# EAGLE design BBB_TFT (EAGLE 6.4)
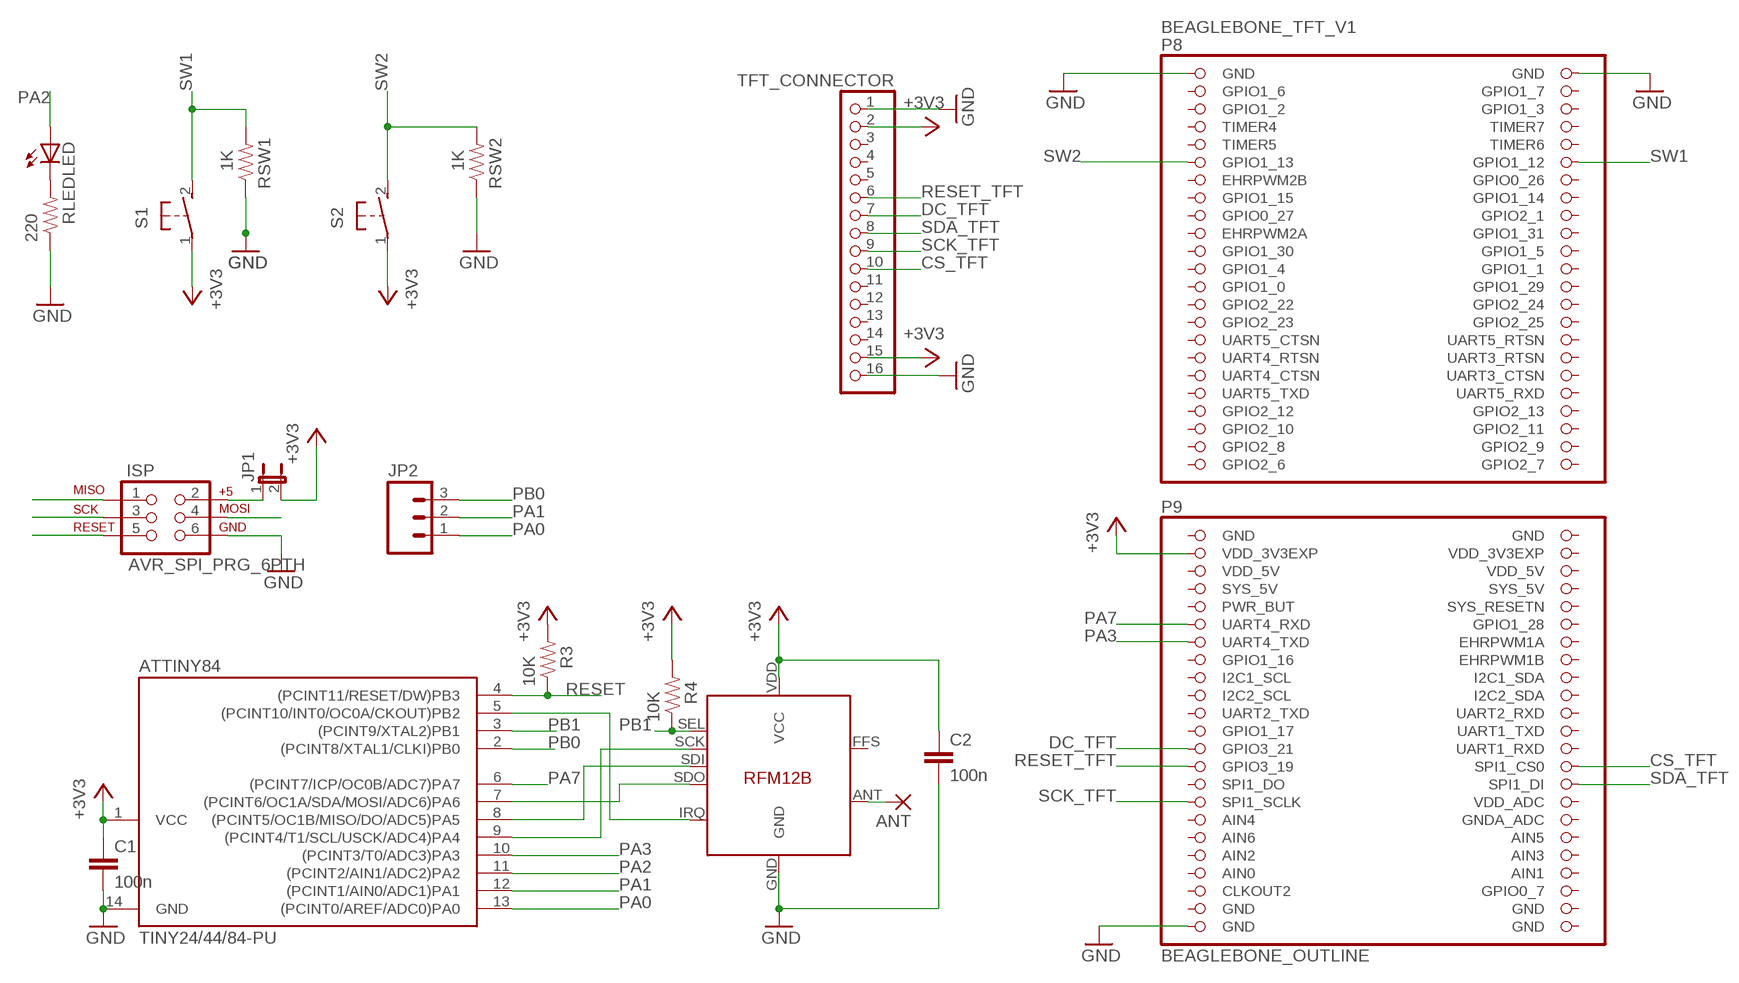
[diagram p0: schematic, sheet 1]

## Parts
ANT  1,6/0,8  [1,6/0,8]
ATTINY84  TINY24/44/84-PU  [DIL14]
BEAGLEBONE_TFT_V1  BEAGLEBONE_OUTLINE  [BEAGLEBONE_SHIELD]
C1  100n  C-EU025-024X044  [C025-024X044]
C2  100n  C-EU025-024X044  [C025-024X044]
ISP  AVR_SPI_PRG_6PTH  [2X3]
JP1  JUMPER-2PTH  [1X02]
JP2  M03LOCK  [1X03_LOCK]
LED  LED5MM  [LED5MM]
R3  10K  RESISTORAXIAL-0.3  [AXIAL-0.3]
R4  10K  RESISTORAXIAL-0.3  [AXIAL-0.3]
RFM12B  RFM12B  [RFM12B]
RLED  220  RESISTORAXIAL-0.3  [AXIAL-0.3]
RSW1  1K  RESISTORAXIAL-0.3  [AXIAL-0.3]
RSW2  1K  RESISTORAXIAL-0.3  [AXIAL-0.3]
S1  31-XX  [B3F-31XX]
S2  31-XX  [B3F-31XX]
TFT_CONNECTOR  PINHD-1X16  [1X16]

## Nets
+3V3 [power]: ATTINY84.1(VCC) BEAGLEBONE_TFT_V1.49(VDD_3V3EXP) C1.1 C2.1 JP1.2 R3.P$2 R4.P$2 RFM12B.VDD(VCC) S1.1(P) S2.1(P) TFT_CONNECTOR.2 TFT_CONNECTOR.15
CS_TFT: BEAGLEBONE_TFT_V1.74(SPI1_CS0) TFT_CONNECTOR.10
DC_TFT: BEAGLEBONE_TFT_V1.71(GPIO3_21) TFT_CONNECTOR.7
GND [power]: ATTINY84.14(GND) BEAGLEBONE_TFT_V1.1(GND) BEAGLEBONE_TFT_V1.2(GND) BEAGLEBONE_TFT_V1.91(GND) C1.2 C2.2 ISP.6 RFM12B.GND RLED.P$1 RSW1.P$1 RSW2.P$1 TFT_CONNECTOR.1 TFT_CONNECTOR.16
MISO: ATTINY84.8((PCINT5/OC1B/MISO/DO/ADC5)PA5) ISP.1 RFM12B.SDI
MOSI: ATTINY84.7((PCINT6/OC1A/SDA/MOSI/ADC6)PA6) ISP.4 RFM12B.SDO
N$1: ISP.2 JP1.1
N$3: LED.K(C) RLED.P$2
N$6 [power]: ANT.1(P) RFM12B.ANT
PA0: ATTINY84.13((PCINT0/AREF/ADC0)PA0) JP2.1
PA1 [power]: ATTINY84.12((PCINT1/AIN0/ADC1)PA1) JP2.2
PA2: ATTINY84.11((PCINT2/AIN1/ADC2)PA2) LED.A
PA3: ATTINY84.10((PCINT3/T0/ADC3)PA3) BEAGLEBONE_TFT_V1.59(UART4_TXD)
PA7: ATTINY84.6((PCINT7/ICP/OC0B/ADC7)PA7) BEAGLEBONE_TFT_V1.57(UART4_RXD)
PB0: ATTINY84.2((PCINT8/XTAL1/CLKI)PB0) JP2.3
PB1: ATTINY84.3((PCINT9/XTAL2)PB1) R4.P$1 RFM12B.SEL
PB2: ATTINY84.5((PCINT10/INT0/OC0A/CKOUT)PB2) RFM12B.IRQ
RESET: ATTINY84.4((PCINT11/RESET/DW)PB3) ISP.5 R3.P$1
RESET_TFT: BEAGLEBONE_TFT_V1.73(GPIO3_19) TFT_CONNECTOR.6
SCK: ATTINY84.9((PCINT4/T1/SCL/USCK/ADC4)PA4) ISP.3 RFM12B.SCK
SCK_TFT: BEAGLEBONE_TFT_V1.77(SPI1_SCLK) TFT_CONNECTOR.9
SDA_TFT: BEAGLEBONE_TFT_V1.76(SPI1_DI) TFT_CONNECTOR.8
SW1: BEAGLEBONE_TFT_V1.12(GPIO1_12) RSW1.P$2 S1.2(S)
SW2: BEAGLEBONE_TFT_V1.11(GPIO1_13) RSW2.P$2 S2.2(S)
Unconnected: BEAGLEBONE_TFT_V1.3(GPIO1_6) BEAGLEBONE_TFT_V1.4(GPIO1_7) BEAGLEBONE_TFT_V1.5(GPIO1_2) BEAGLEBONE_TFT_V1.6(GPIO1_3) BEAGLEBONE_TFT_V1.7(TIMER4) BEAGLEBONE_TFT_V1.8(TIMER7) BEAGLEBONE_TFT_V1.9(TIMER5) BEAGLEBONE_TFT_V1.10(TIMER6) BEAGLEBONE_TFT_V1.13(EHRPWM2B) BEAGLEBONE_TFT_V1.14(GPIO0_26) BEAGLEBONE_TFT_V1.15(GPIO1_15) BEAGLEBONE_TFT_V1.16(GPIO1_14) BEAGLEBONE_TFT_V1.17(GPIO0_27) BEAGLEBONE_TFT_V1.18(GPIO2_1) BEAGLEBONE_TFT_V1.19(EHRPWM2A) BEAGLEBONE_TFT_V1.20(GPIO1_31) BEAGLEBONE_TFT_V1.21(GPIO1_30) BEAGLEBONE_TFT_V1.22(GPIO1_5) BEAGLEBONE_TFT_V1.23(GPIO1_4) BEAGLEBONE_TFT_V1.24(GPIO1_1) BEAGLEBONE_TFT_V1.25(GPIO1_0) BEAGLEBONE_TFT_V1.26(GPIO1_29) BEAGLEBONE_TFT_V1.27(GPIO2_22) BEAGLEBONE_TFT_V1.28(GPIO2_24) BEAGLEBONE_TFT_V1.29(GPIO2_23) BEAGLEBONE_TFT_V1.30(GPIO2_25) BEAGLEBONE_TFT_V1.31(UART5_CTSN) BEAGLEBONE_TFT_V1.32(UART5_RTSN) BEAGLEBONE_TFT_V1.33(UART4_RTSN) BEAGLEBONE_TFT_V1.34(UART3_RTSN) BEAGLEBONE_TFT_V1.35(UART4_CTSN) BEAGLEBONE_TFT_V1.36(UART3_CTSN) BEAGLEBONE_TFT_V1.37(UART5_TXD) BEAGLEBONE_TFT_V1.38(UART5_RXD) BEAGLEBONE_TFT_V1.39(GPIO2_12) BEAGLEBONE_TFT_V1.40(GPIO2_13) BEAGLEBONE_TFT_V1.41(GPIO2_10) BEAGLEBONE_TFT_V1.42(GPIO2_11) BEAGLEBONE_TFT_V1.43(GPIO2_8) BEAGLEBONE_TFT_V1.44(GPIO2_9) BEAGLEBONE_TFT_V1.45(GPIO2_6) BEAGLEBONE_TFT_V1.46(GPIO2_7) BEAGLEBONE_TFT_V1.54(SYS_5V) BEAGLEBONE_TFT_V1.55(PWR_BUT) BEAGLEBONE_TFT_V1.56(SYS_RESETN) BEAGLEBONE_TFT_V1.58(GPIO1_28) BEAGLEBONE_TFT_V1.60(EHRPWM1A) BEAGLEBONE_TFT_V1.61(GPIO1_16) BEAGLEBONE_TFT_V1.62(EHRPWM1B) BEAGLEBONE_TFT_V1.63(I2C1_SCL) BEAGLEBONE_TFT_V1.64(I2C1_SDA) BEAGLEBONE_TFT_V1.65(I2C2_SCL) BEAGLEBONE_TFT_V1.66(I2C2_SDA) BEAGLEBONE_TFT_V1.67(UART2_TXD) BEAGLEBONE_TFT_V1.68(UART2_RXD) BEAGLEBONE_TFT_V1.69(GPIO1_17) BEAGLEBONE_TFT_V1.70(UART1_TXD) BEAGLEBONE_TFT_V1.72(UART1_RXD) BEAGLEBONE_TFT_V1.75(SPI1_DO) BEAGLEBONE_TFT_V1.78(VDD_ADC) BEAGLEBONE_TFT_V1.79(AIN4) BEAGLEBONE_TFT_V1.80(GNDA_ADC) BEAGLEBONE_TFT_V1.81(AIN6) BEAGLEBONE_TFT_V1.82(AIN5) BEAGLEBONE_TFT_V1.83(AIN2) BEAGLEBONE_TFT_V1.84(AIN3) BEAGLEBONE_TFT_V1.86(AIN1) BEAGLEBONE_TFT_V1.87(CLKOUT2) BEAGLEBONE_TFT_V1.88(GPIO0_7) RFM12B.FFS TFT_CONNECTOR.3 TFT_CONNECTOR.4 TFT_CONNECTOR.5 TFT_CONNECTOR.11 TFT_CONNECTOR.12 TFT_CONNECTOR.13 TFT_CONNECTOR.14

## Power pins joined to a net without a drawn wire
AIN0: BEAGLEBONE_TFT_V1.85(AIN0)
GND: BEAGLEBONE_TFT_V1.47(GND) BEAGLEBONE_TFT_V1.48(GND) BEAGLEBONE_TFT_V1.89(GND) BEAGLEBONE_TFT_V1.90(GND) BEAGLEBONE_TFT_V1.92(GND)
SYS_5V: BEAGLEBONE_TFT_V1.53(SYS_5V)
VDD_3V3EXP: BEAGLEBONE_TFT_V1.50(VDD_3V3EXP)
VDD_5V: BEAGLEBONE_TFT_V1.51(VDD_5V) BEAGLEBONE_TFT_V1.52(VDD_5V)

## Library data of the parts
ANT = JeeLabs:1,6/0,8: THROUGH-HOLE PAD
ATTINY84 = avr-7:TINY24/44/84
BEAGLEBONE_TFT_V1 = adafruit:BEAGLEBONE_OUTLINE: Should match A3 pinout - but not completely tested
C1 C2 = rcl:C-EU: CAPACITOR, European symbol
ISP = SparkFun:AVR_SPI_PRG_6: AVR ISP 6 Pin This is the reduced ISP connector for AVR programming. Common on Arduino. This footprint will take up less PCB space and can be used with a 10-pin to 6-pin adapter such as SKU: BOB-08508
JP1 = SparkFun:JUMPER-2: Jumper Basic 0.1" spaced jumper. Use with breakaway headers.
JP2 = SparkFun:M03: Header 3 Standard 3-pin 0.1" header. Use with straight break away headers (SKU : PRT-00116), right angle break away headers (PRT-00553), swiss pins (PRT-00743), machine pins (PRT-00117), and female headers (PRT-00115). Molex polarized connector foot print use with SKU : PRT-08232 with associated crimp pins and housings.
LED = led:LED: LED OSRAM: - CHIPLED LG R971, LG N971, LY N971, LG Q971, LY Q971, LO R971, LY R971 LH N974, LH R974 LS Q976, LO Q976, LY Q976 LO Q996 - Hyper CHIPLED LW Q18S LB Q993, LB Q99A, LB R99A - SideLED LS A670, LO A670, LY A670, LG A670, LP A670 LB A673, LV A673, LT A673, LW A673 LH A674 LY A675 LS A676, LA A676, LO A676, LY A676, LW A676 LS A679, LY A679, LG A679 - Hyper Micro SIDELED® LS Y876, LA Y876, LO Y876, LY Y876 LT Y87S - SmartLED LW L88C, LW L88S LB L89C, LB L89S, LG L890 LS L89K, LO L89K, LY L89K LS L896, LA L896, LO L896, LY L896 - TOPLED LS T670, LO T670, LY T670, LG T670, LP T670 LSG T670, LSP T670, LSY T670, LOP T670, LYG T670 LG T671, LOG T671, LSG T671 LB T673, LV T673, LT T673, LW T673 LH T674 LS T676, LA T676, LO T676, LY T676, LB T676, LH T676, LSB T676, LW T676 LB T67C, LV T67C, LT T67C, LS T67K, LO T67K, LY T67K, LW E67C LS E67B, LA E67B, LO E67B, LY E67B, LB E67C, LV E67C, LT E67C LW T67C LS T679, LY T679, LG T679 LS T770, LO T770, LY T770, LG T770, LP T770 LB T773, LV T773, LT T773, LW T773 LH T774 LS E675, LA E675, LY E675, LS T675 LS T776, LA T776, LO T776, LY T776, LB T776 LHGB T686 LT T68C, LB T68C - Hyper Mini TOPLED® LB M676 - Mini TOPLED Santana® LG M470 LS M47K, LO M47K, LY M47K Source: http://www.osram.convergy.de LUXEON: - LUMILED® LXK2-PW12-R00, LXK2-PW12-S00, LXK2-PW14-U00, LXK2-PW14-V00 LXK2-PM12-R00, LXK2-PM12-S00, LXK2-PM14-U00 LXK2-PE12-Q00, LXK2-PE12-R00, LXK2-PE12-S00, LXK2-PE14-T00, LXK2-PE14-U00 LXK2-PB12-K00, LXK2-PB12-L00, LXK2-PB12-M00, LXK2-PB14-N00, LXK2-PB14-P00, LXK2-PB14-Q00 LXK2-PR12-L00, LXK2-PR12-M00, LXK2-PR14-Q00, LXK2-PR14-R00 LXK2-PD12-Q00, LXK2-PD12-R00, LXK2-PD12-S00 LXK2-PH12-R00, LXK2-PH12-S00 LXK2-PL12-P00, LXK2-PL12-Q00, LXK2-PL12-R00 Source: www.luxeon.com KINGBRIGHT: KA-3528ASYC Source: www.kingbright.com
R3 R4 RLED RSW1 RSW2 = SparkFun:RESISTOR: Resistor Basic schematic elements and footprints for 0603, 1206, and PTH resistors.
RFM12B = JeeLabs:RFM12B
S1 S2 = switch-omron:31-XX: OMRON SWITCH; MPN: B3F-3100; OC_FARNELL: 959704; OC_NEWARK: 36M3582
TFT_CONNECTOR = pinhead:PINHD-1X16: PIN HEADER

## Net classes
0 default: width 0.254 mm, drill 0.254 mm, clearance 0.254 mm
1 power: width 0.305 mm, drill 0.305 mm, clearance 0.305 mm

## Board
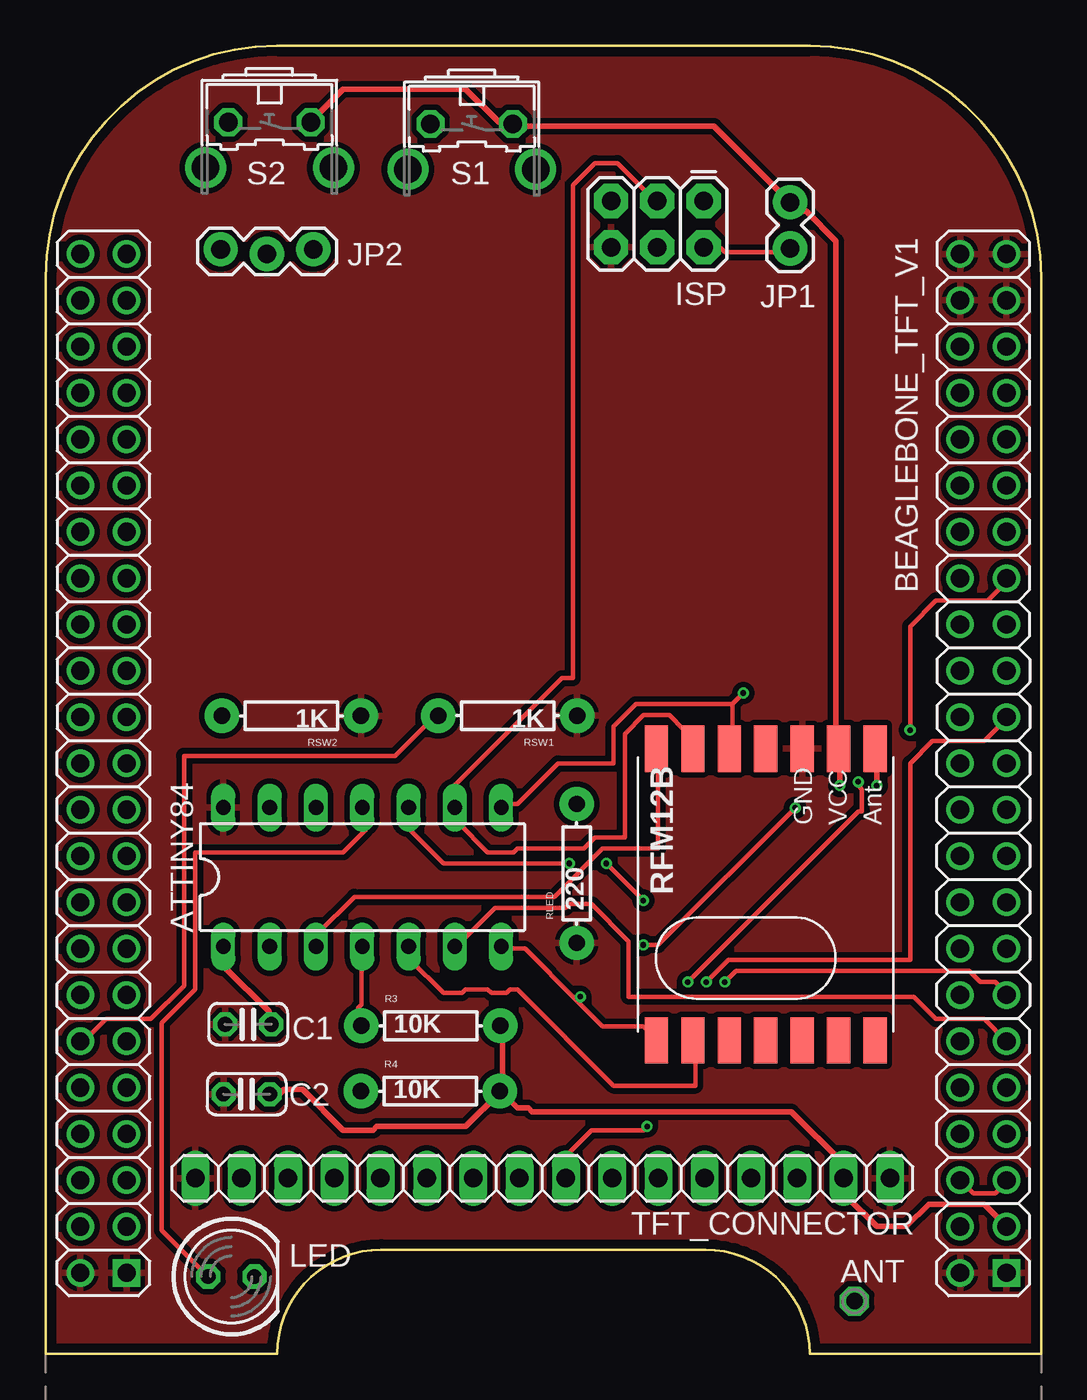
[diagram p1: board, top side]
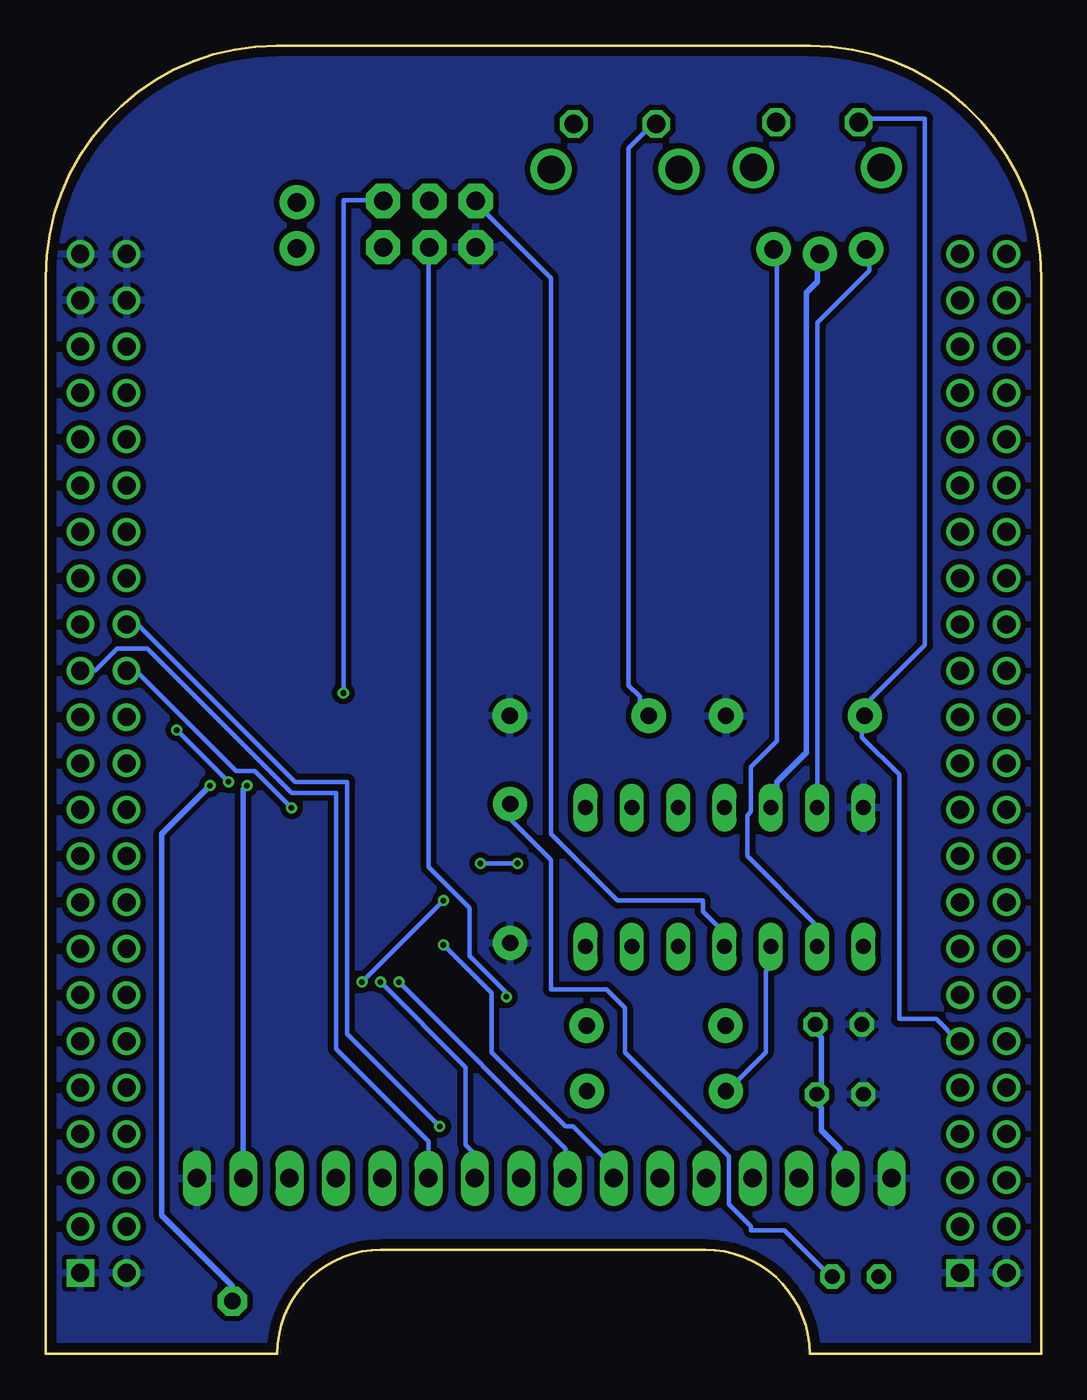
[diagram p2: board, bottom side, seen from below]

Size 54.61 x 71.75 mm. Coordinates in mm from the lower left corner, seen from the top.
Copper layers (1*16): Top 0.035mm / dielectric 1.5mm / Bottom 0.035mm
Design rules "EagleRules": minimum track width 7mil, minimum drill 12mil, track to track 7mil, track to pad 7mil, pad to pad 7mil, via to via 7mil, smd to smd 0mil, copper to edge 20mil, drill to drill 10mil, minimum pad ring 10mil, minimum via ring 6mil, stop-mask expansion 2mil, vias tented up to drill 25mil, thermal gap 10mil

### Footprints (pad centres in the part's own frame; a part is rotated, then mirrored left to right if it is on the bottom)
1,6/0,8 = drill 0.9 pad 1.6 octagon: 1 0,0
DIL14 = drill 0.813 long: 1 -7.62,-3.81; 2 -5.08,-3.81; 3 -2.54,-3.81; 4 0,-3.81; 5 2.54,-3.81; 6 5.08,-3.81; 7 7.62,-3.81; 8 7.62,3.81; 9 5.08,3.81; 10 2.54,3.81; 11 0,3.81; 12 -2.54,3.81; 13 -5.08,3.81; 14 -7.62,3.81
BEAGLEBONE_SHIELD = drill 1 square: 1 4.445,19.05; 47 52.705,19.05 | drill 1: 2 1.905,19.05; 3 4.445,21.59; 4 1.905,21.59; 5 4.445,24.13; 6 1.905,24.13; 7 4.445,26.67; 8 1.905,26.67; 9 4.445,29.21; 10 1.905,29.21; 11 4.445,31.75; 12 1.905,31.75; 13 4.445,34.29; 14 1.905,34.29; 15 4.445,36.83; 16 1.905,36.83; 17 4.445,39.37; 18 1.905,39.37; 19 4.445,41.91; 20 1.905,41.91; 21 4.445,44.45; 22 1.905,44.45; 23 4.445,46.99; 24 1.905,46.99; 25 4.445,49.53; 26 1.905,49.53; 27 4.445,52.07; 28 1.905,52.07; 29 4.445,54.61; 30 1.905,54.61; 31 4.445,57.15; 32 1.905,57.15; 33 4.445,59.69; 34 1.905,59.69; 35 4.445,62.23; 36 1.905,62.23; 37 4.445,64.77; 38 1.905,64.77; 39 4.445,67.31; 40 1.905,67.31; 41 4.445,69.85; 42 1.905,69.85; 43 4.445,72.39; 44 1.905,72.39; 45 4.445,74.93; 46 1.905,74.93; 48 50.165,19.05; 49 52.705,21.59; 50 50.165,21.59; 51 52.705,24.13; 52 50.165,24.13; 53 52.705,26.67; 54 50.165,26.67; 55 52.705,29.21; 56 50.165,29.21; 57 52.705,31.75; 58 50.165,31.75; 59 52.705,34.29; 60 50.165,34.29; 61 52.705,36.83; 62 50.165,36.83; 63 52.705,39.37; 64 50.165,39.37; 65 52.705,41.91; 66 50.165,41.91; 67 52.705,44.45; 68 50.165,44.45; 69 52.705,46.99; 70 50.165,46.99; 71 52.705,49.53; 72 50.165,49.53; 73 52.705,52.07; 74 50.165,52.07; 75 52.705,54.61; 76 50.165,54.61; 77 52.705,57.15; 78 50.165,57.15; 79 52.705,59.69; 80 50.165,59.69; 81 52.705,62.23; 82 50.165,62.23; 83 52.705,64.77; 84 50.165,64.77; 85 52.705,67.31; 86 50.165,67.31; 87 52.705,69.85; 88 50.165,69.85; 89 52.705,72.39; 90 50.165,72.39; 91 52.705,74.93; 92 50.165,74.93
C025-024X044 = drill 0.813 octagon: 1 -1.27,0; 2 1.27,0
2X3 = drill 1.016 pad 1.88 octagon: 1 0,0; 2 0,2.54; 3 2.54,0; 4 2.54,2.54; 5 5.08,0; 6 5.08,2.54
1X02 = drill 1.016 pad 1.88: 1 0,0; 2 2.54,0
1X03_LOCK = drill 1.016 pad 1.88: 1 0,0.127; 2 2.54,-0.127; 3 5.08,0.127
LED5MM = drill 0.813 octagon: A -1.27,0; K 1.27,0
AXIAL-0.3 = drill 0.9 pad 1.88: P$1 -3.81,0; P$2 3.81,0
RFM12B = smd 2.54 x 1.27: ANT 8,-6; FFS -8,2; GND 8,-2; IRQ -8,4; P$8 -8,0; P$9 -8,-2; P$10 -8,-4; P$12 -8,-6; P$16 8,0; SCK 8,4; SDI 8,2; SDO -8,6; SEL 8,6; VDD 8,-4
B3F-31XX = drill 1.016 octagon: 1 -2.261,-1.245; 2 2.261,-1.245 | drill 1.499 pad 2.159: 3 -3.505,1.245; 4 3.505,1.245
1X16 = drill 1.016 long: 1 -19.05,0; 2 -16.51,0; 3 -13.97,0; 4 -11.43,0; 5 -8.89,0; 6 -6.35,0; 7 -3.81,0; 8 -1.27,0; 9 1.27,0; 10 3.81,0; 11 6.35,0; 12 8.89,0; 13 11.43,0; 14 13.97,0; 15 16.51,0; 16 19.05,0

### Placement (x,y rotation side)
ANT  44.36,2.89 0 top
ATTINY84  17.37,26.15 0 top
BEAGLEBONE_TFT_V1  0,-14.61 0 top
C1  11.11,18.08 180 top
C2  11.03,14.24 180 top
ISP  36.09,63.24 180 top
JP1  40.83,60.62 90 top
JP2  9.6,60.46 0 top
LED  10.19,4.24 0 top
R3  21.13,18 0 top
R4  21.1,14.41 0 top
RFM12B  39.5,25.2 90 top
RLED  29.13,26.35 90 top
RSW1  25.34,35 180 top
RSW2  13.49,35 180 top
S1  23.38,66.21 180 top
S2  12.28,66.31 180 top
TFT_CONNECTOR  27.26,9.63 180 top

### Tracks (layer width: path | path; a pad name or v marks a point on that pad's centre or on a via)
+3V3  (via drill 0.3)
  Top 0.305: S2.1 14.7,67.74 16.33,69.37 23.03,69.37 24.86,67.54 25.47,67.54 S1.1 25.68,67.34 36.65,67.34 40.71,63.27 JP1.2 40.92,63.07 41.32,62.66 41.73,62.66 43.35,61.04 43.35,33.2 RFM12B.VDD 43.56,33 v43.56,31.17 | R4.P$2 25.07,14.51 25.07,17.96 R3.P$2 | ATTINY84.1 9.83,22.23 9.83,21.21 12.26,18.77 12.26,18.16 C1.1 | R4.P$2 24.86,14.3 23.03,12.47 18.16,12.47 17.95,12.27 16.33,12.27 14.09,14.51 13.08,14.51 12.87,14.3 12.47,14.3 C2.1 | BEAGLEBONE_TFT_V1.49 51.48,8.21 48.43,8.21 47.22,6.99 45.59,6.99 43.96,8.61 43.96,9.63 TFT_CONNECTOR.2 43.76,9.83 43.76,10.44 40.92,13.29 26.69,13.29 26.49,13.49 25.88,13.49 25.07,14.3 R4.P$2
  Bottom 0.305: C1.1 12.26,17.96 12.26,17.55 12.06,17.35 12.06,14.51 12.26,14.3 C2.1 12.26,14.1 12.26,13.69 12.06,13.49 12.06,12.27 11.05,11.25 11.05,10.04 10.84,9.83 TFT_CONNECTOR.15 | v43.56,31.17 43.76,30.97 43.76,9.83 TFT_CONNECTOR.2
CS_TFT  (via drill 0.3)
  Top 0.254: v41.12,29.95 33.6,22.43 v32.79,22.43
  Bottom 0.254: v41.12,29.95 43.15,31.98 44.17,31.98 49.45,37.26 50.06,37.26 BEAGLEBONE_TFT_V1.74 | v32.79,22.43 30.15,19.79 30.15,16.54 26.08,12.47 25.68,12.47 23.64,10.44 23.64,9.83 TFT_CONNECTOR.10
DC_TFT  (via drill 0.3)
  Top 0.254: v36.24,20.4 37.46,21.62 47.42,21.62 47.42,32.39 48.64,33.61 51.48,33.61 52.7,34.83 BEAGLEBONE_TFT_V1.71
  Bottom 0.254: v36.24,20.4 31.57,15.73 31.57,11.46 31.16,11.05 31.16,9.83 TFT_CONNECTOR.7
GND
  pour Bottom: 55.94,-15.92 -2.85,-15.73 -2.85,72.87 56.23,72.97
  pour Top: 56.06,-16.14 -2.77,-15.75 -2.78,72.87 56.25,72.97
MISO  (via drill 0.3)
  Top 0.254: 37.66,35.64 37.66,33.2 RFM12B.SDI | 37.66,35.64 32.38,35.64 31.16,34.42 31.16,32.39 28.11,32.39 25.88,30.15 25.07,30.15 ATTINY84.8 | 37.66,35.64 v38.27,36.25
  Bottom 0.254: v38.27,36.25 38.27,63.27 36.24,63.27 ISP.1
MOSI  (via drill 0.3)
  Top 0.254: 29.13,19.38 26.29,22.23 25.07,22.23 ATTINY84.7 | 29.13,19.38 30.55,17.96 32.79,17.96 33.4,17.35 RFM12B.SDO | 29.13,19.38 v29.33,19.59
  Bottom 0.254: v29.33,19.59 29.33,19.79 31.37,21.82 31.37,24.46 33.6,26.7 33.6,60.63 ISP.4
N$1
  Top 0.254: JP1.1 40.71,60.43 37.26,60.43 37.06,60.63 36.24,60.63 ISP.2
N$3
  Bottom 0.254: LED.K 11.66,4.35 14.09,6.78 15.92,6.78 15.92,6.99 17.14,8.21 17.14,10.85 22.83,16.54 22.83,18.98 23.85,19.99 26.9,19.99 26.9,27.1 29.13,29.34 RLED.P$2
N$6  (via drill 0.3)
  Top 0.305: v45.59,31.17 45.59,33 RFM12B.ANT
  Bottom 0.305: v45.59,31.17 48.23,28.53 48.23,7.6 44.37,3.74 44.37,2.92 ANT.1
PA0
  Bottom 0.254: ATTINY84.13 12.26,30.15 12.26,56.57 9.42,59.41 9.42,60.43 JP2.1
PA1
  Bottom 0.305: ATTINY84.12 14.7,30.15 14.5,30.36 14.5,31.37 12.87,33 12.87,58.19 12.26,58.8 12.26,60.23 JP2.2
PA2
  Top 0.254: LED.A 8.81,4.35 6.37,6.78 6.37,18.16 8.2,19.99 8.2,27.51 16.33,27.51 17.55,28.73 17.55,29.95 ATTINY84.11
PA3  (via drill 0.3)
  Top 0.254: v28.72,26.9 21.82,26.9 19.99,28.73 19.99,29.95 ATTINY84.10 | v32.79,24.87 v30.76,26.9 | v37.26,20.4 37.87,21.01 50.67,21.01 51.28,20.4 52.09,20.4 52.7,19.79 BEAGLEBONE_TFT_V1.59
  Bottom 0.254: v30.76,26.9 v28.72,26.9 | v37.26,20.4 v32.79,24.87
PA7
  Top 0.254: ATTINY84.6 22.63,22.43 24.66,24.46 28.52,24.46 28.72,24.67 29.94,24.67 31.98,22.63 31.98,19.59 47.62,19.59 48.84,18.37 51.48,18.37 BEAGLEBONE_TFT_V1.57
PB0
  Bottom 0.254: ATTINY84.2 12.47,22.43 12.47,23.65 16.13,27.31 16.13,29.54 15.92,29.75 15.92,32.18 14.5,33.61 14.5,60.43 JP2.3
PB1
  Top 0.254: RFM12B.SEL 33.6,33 33.6,27.71 30.55,27.71 27.91,25.07 16.94,25.07 14.91,23.04 14.91,22.43 ATTINY84.3
  Bottom 0.254: R4.P$1 17.14,14.51 15.11,16.54 15.11,21.01 14.91,21.21 14.91,22.23 ATTINY84.3
PB2
  Top 0.254: RFM12B.IRQ 35.63,17.15 35.63,14.71 31.16,14.71 25.88,19.99 25.47,19.99 25.27,19.79 24.46,19.79 24.25,19.99 23.03,19.99 22.83,19.79 21.82,19.79 19.99,21.62 19.99,22.23 ATTINY84.5
RESET
  Top 0.254: ATTINY84.4 17.34,22.23 17.34,19.18 17.14,18.98 17.14,18.16 R3.P$1
  Bottom 0.254: ISP.5 30.96,63.07 26.9,59.01 26.9,28.53 23.24,24.87 18.56,24.87 18.56,24.26 17.55,23.24 17.55,22.43 ATTINY84.4
RESET_TFT
  Bottom 0.254: BEAGLEBONE_TFT_V1.73 51.89,37.47 50.67,38.69 49.04,38.69 41.12,30.76 38.68,30.76 38.68,16.74 33.6,11.66 33.6,9.83 TFT_CONNECTOR.6
SCK
  Top 0.254: RFM12B.SCK 35.43,33.2 35.43,34.22 35.02,34.22 34.21,35.03 32.79,35.03 31.77,34.01 31.77,28.32 30.15,28.32 29.54,27.71 25.88,27.71 25.68,27.51 24.25,27.51 22.63,29.14 22.63,29.95 ATTINY84.9 22.42,30.15 22.42,31.17 28.32,37.06 28.93,37.06 28.93,64.09 30.15,65.31 31.37,65.31 33.4,63.27 ISP.3
SCK_TFT  (via drill 0.3)
  Top 0.254: v47.42,34.22 47.42,39.91 48.84,41.33 51.69,41.33 52.7,42.34 BEAGLEBONE_TFT_V1.77 | v44.57,31.37 44.57,31.17 44.78,30.97 44.78,29.75 44.57,29.75 v35.23,20.4
  Bottom 0.254: v44.57,31.37 v47.42,34.22 | v35.23,20.4 26.08,11.25 26.08,9.83 TFT_CONNECTOR.9
SDA_TFT  (via drill 0.3)
  Top 0.254: v32.99,12.47 32.79,12.27 29.94,12.27 28.72,11.05 28.72,9.83 TFT_CONNECTOR.8
  Bottom 0.254: v32.99,12.47 38.07,17.55 38.07,31.37 40.92,31.37 49.45,39.91 50.06,39.91 BEAGLEBONE_TFT_V1.76
SW1
  Top 0.254: BEAGLEBONE_TFT_V1.12 2.1,17.15 3.32,18.37 5.76,18.37 7.59,20.2 7.59,32.79 19.17,32.79 21.21,34.83 21.41,34.83 RSW1.P$2
  Bottom 0.254: S1.2 21.21,67.34 21.61,67.34 21.61,67.13 22.63,66.12 22.63,36.65 22.02,36.05 22.02,35.44 21.61,35.03 RSW1.P$2
SW2
  Bottom 0.254: BEAGLEBONE_TFT_V1.11 4.54,17.15 5.76,18.37 7.79,18.37 7.79,31.78 9.83,33.81 9.83,34.83 RSW2.P$2 9.62,35.03 9.62,35.64 6.37,38.89 6.37,67.74 9.83,67.74 S2.2
VDD_5V
  Top 0.254: BEAGLEBONE_TFT_V1.52 50.26,9.43 50.87,8.82 52.09,8.82 52.7,9.43 BEAGLEBONE_TFT_V1.51